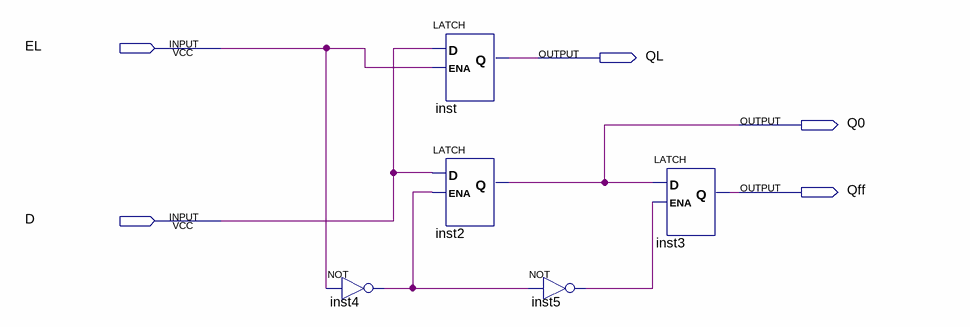
[diagram p0: schematic sheet]
// Quartus schematic bascule.bdf as structural Verilog: 5 symbols, 5 pins
module bascule (
  input  EL,
  input  D,
  output QL,
  output Q0,
  output Qff
);

  wire inst4_out, inst5_out;

  not inst4 (inst4_out, EL);
  LATCH inst (.D(D), .ENA(EL), .Q(QL));
  LATCH inst2 (.D(D), .ENA(inst4_out), .Q(Q0));
  not inst5 (inst5_out, inst4_out);
  LATCH inst3 (.D(Q0), .ENA(inst5_out), .Q(Qff));
endmodule
